# Altium schematic sheet T_Proj.SchDoc
size A4
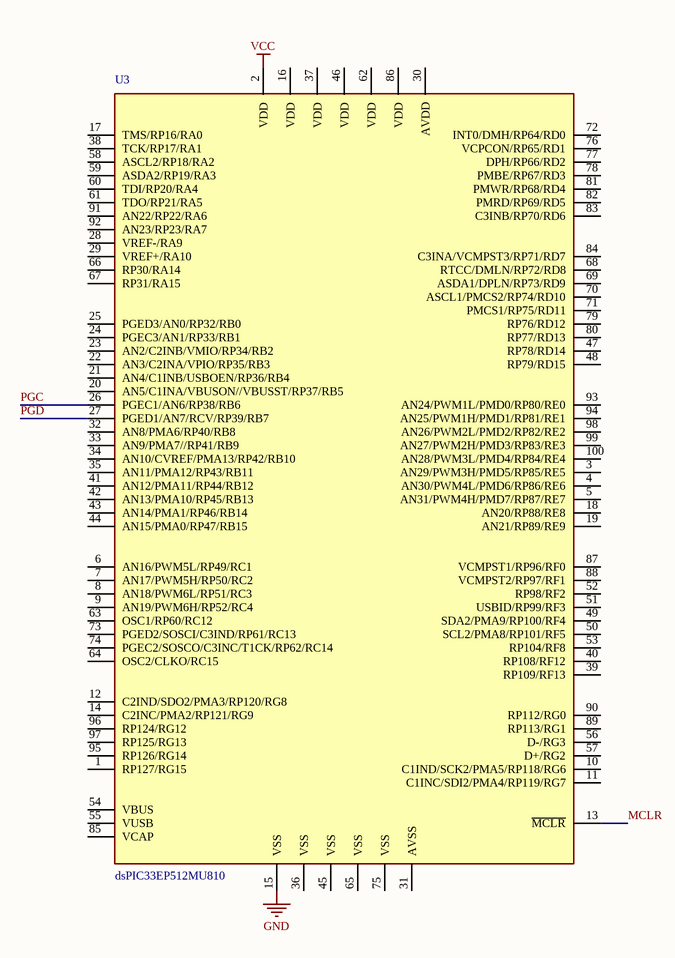
[diagram p0: T_Proj.SchDoc]

## Parts
U3  dsPIC33EP512MU810  [MA330025-1]

## Nets
GND: U3.15(VSS)
VCC: U3.2(VDD)
MCLR: U3.13(~{MCLR})
PGC: U3.26(PGEC1/AN6/RP38/RB6)
PGD: U3.27(PGED1/AN7/RCV/RP39/RB7)

Not connected (* = marked no-connect by the designer): U3 1(RP127/RG15) 3(AN29/PWM3H/PMD5/RP85/RE5) 4(AN30/PWM4L/PMD6/RP86/RE6) 5(AN31/PWM4H/PMD7/RP87/RE7) 6(AN16/PWM5L/RP49/RC1) 7(AN17/PWM5H/RP50/RC2) 8(AN18/PWM6L/RP51/RC3) 9(AN19/PWM6H/RP52/RC4) 10(C1IND/SCK2/PMA5/RP118/RG6) 11(C1INC/SDI2/PMA4/RP119/RG7) 12(C2IND/SDO2/PMA3/RP120/RG8) 14(C2INC/PMA2/RP121/RG9) 16(VDD) 17(TMS/RP16/RA0) 18(AN20/RP88/RE8) 19(AN21/RP89/RE9) 20(AN5/C1INA/VBUSON//VBUSST/RP37/RB5) 21(AN4/C1INB/USBOEN/RP36/RB4) 22(AN3/C2INA/VPIO/RP35/RB3) 23(AN2/C2INB/VMIO/RP34/RB2) 24(PGEC3/AN1/RP33/RB1) 25(PGED3/AN0/RP32/RB0) 28(VREF-/RA9) 29(VREF+/RA10) 30(AVDD) 31(AVSS) 32(AN8/PMA6/RP40/RB8) 33(AN9/PMA7//RP41/RB9) 34(AN10/CVREF/PMA13/RP42/RB10) 35(AN11/PMA12/RP43/RB11) 36(VSS) 37(VDD) 38(TCK/RP17/RA1) 39(RP109/RF13) 40(RP108/RF12) 41(AN12/PMA11/RP44/RB12) 42(AN13/PMA10/RP45/RB13) 43(AN14/PMA1/RP46/RB14) 44(AN15/PMA0/RP47/RB15) 45(VSS) 46(VDD) 47(RP78/RD14) 48(RP79/RD15) 49(SDA2/PMA9/RP100/RF4) 50(SCL2/PMA8/RP101/RF5) 51(USBID/RP99/RF3) 52(RP98/RF2) 53(RP104/RF8) 54(VBUS) 55(VUSB) 56(D-/RG3) 57(D+/RG2) 58(ASCL2/RP18/RA2) 59(ASDA2/RP19/RA3) 60(TDI/RP20/RA4) 61(TDO/RP21/RA5) 62(VDD) 63(OSC1/RP60/RC12) 64(OSC2/CLKO/RC15) 65(VSS) 66(RP30/RA14) 67(RP31/RA15) 68(RTCC/DMLN/RP72/RD8) 69(ASDA1/DPLN/RP73/RD9) 70(ASCL1/PMCS2/RP74/RD10) 71(PMCS1/RP75/RD11) 72(INT0/DMH/RP64/RD0) 73(PGED2/SOSCI/C3IND/RP61/RC13) 74(PGEC2/SOSCO/C3INC/T1CK/RP62/RC14) 75(VSS) 76(VCPCON/RP65/RD1) 77(DPH/RP66/RD2) 78(PMBE/RP67/RD3) 79(RP76/RD12) 80(RP77/RD13) 81(PMWR/RP68/RD4) 82(PMRD/RP69/RD5) 83(C3INB/RP70/RD6) 84(C3INA/VCMPST3/RP71/RD7) 85(VCAP) 86(VDD) 87(VCMPST1/RP96/RF0) 88(VCMPST2/RP97/RF1) 89(RP113/RG1) 90(RP112/RG0) 91(AN22/RP22/RA6) 92(AN23/RP23/RA7) 93(AN24/PWM1L/PMD0/RP80/RE0) 94(AN25/PWM1H/PMD1/RP81/RE1) 95(RP126/RG14) 96(RP124/RG12) 97(RP125/RG13) 98(AN26/PWM2L/PMD2/RP82/RE2) 99(AN27/PWM2H/PMD3/RP83/RE3) 100(AN28/PWM3L/PMD4/RP84/RE4)

## Library data of the parts
U3 = dsPIC33EP512MU810: Manufacturer: MICROCHIP; Supplier 1: Farnell; Supplier Part Number 1: 1971935; Manufacturer Part Number: MA330025-1; Pricing: 1=22,55 (EUR); ComponentLink1URL: http://ww1.microchip.com/downloads/en/DeviceDoc/PIM_810_infosheet.pdf; ComponentLink1Description: http://ww1.microchip.com/downloads/en/DeviceDoc/PIM_810_infosheet.pdf